# EAGLE design node (EAGLE 8.3.2)
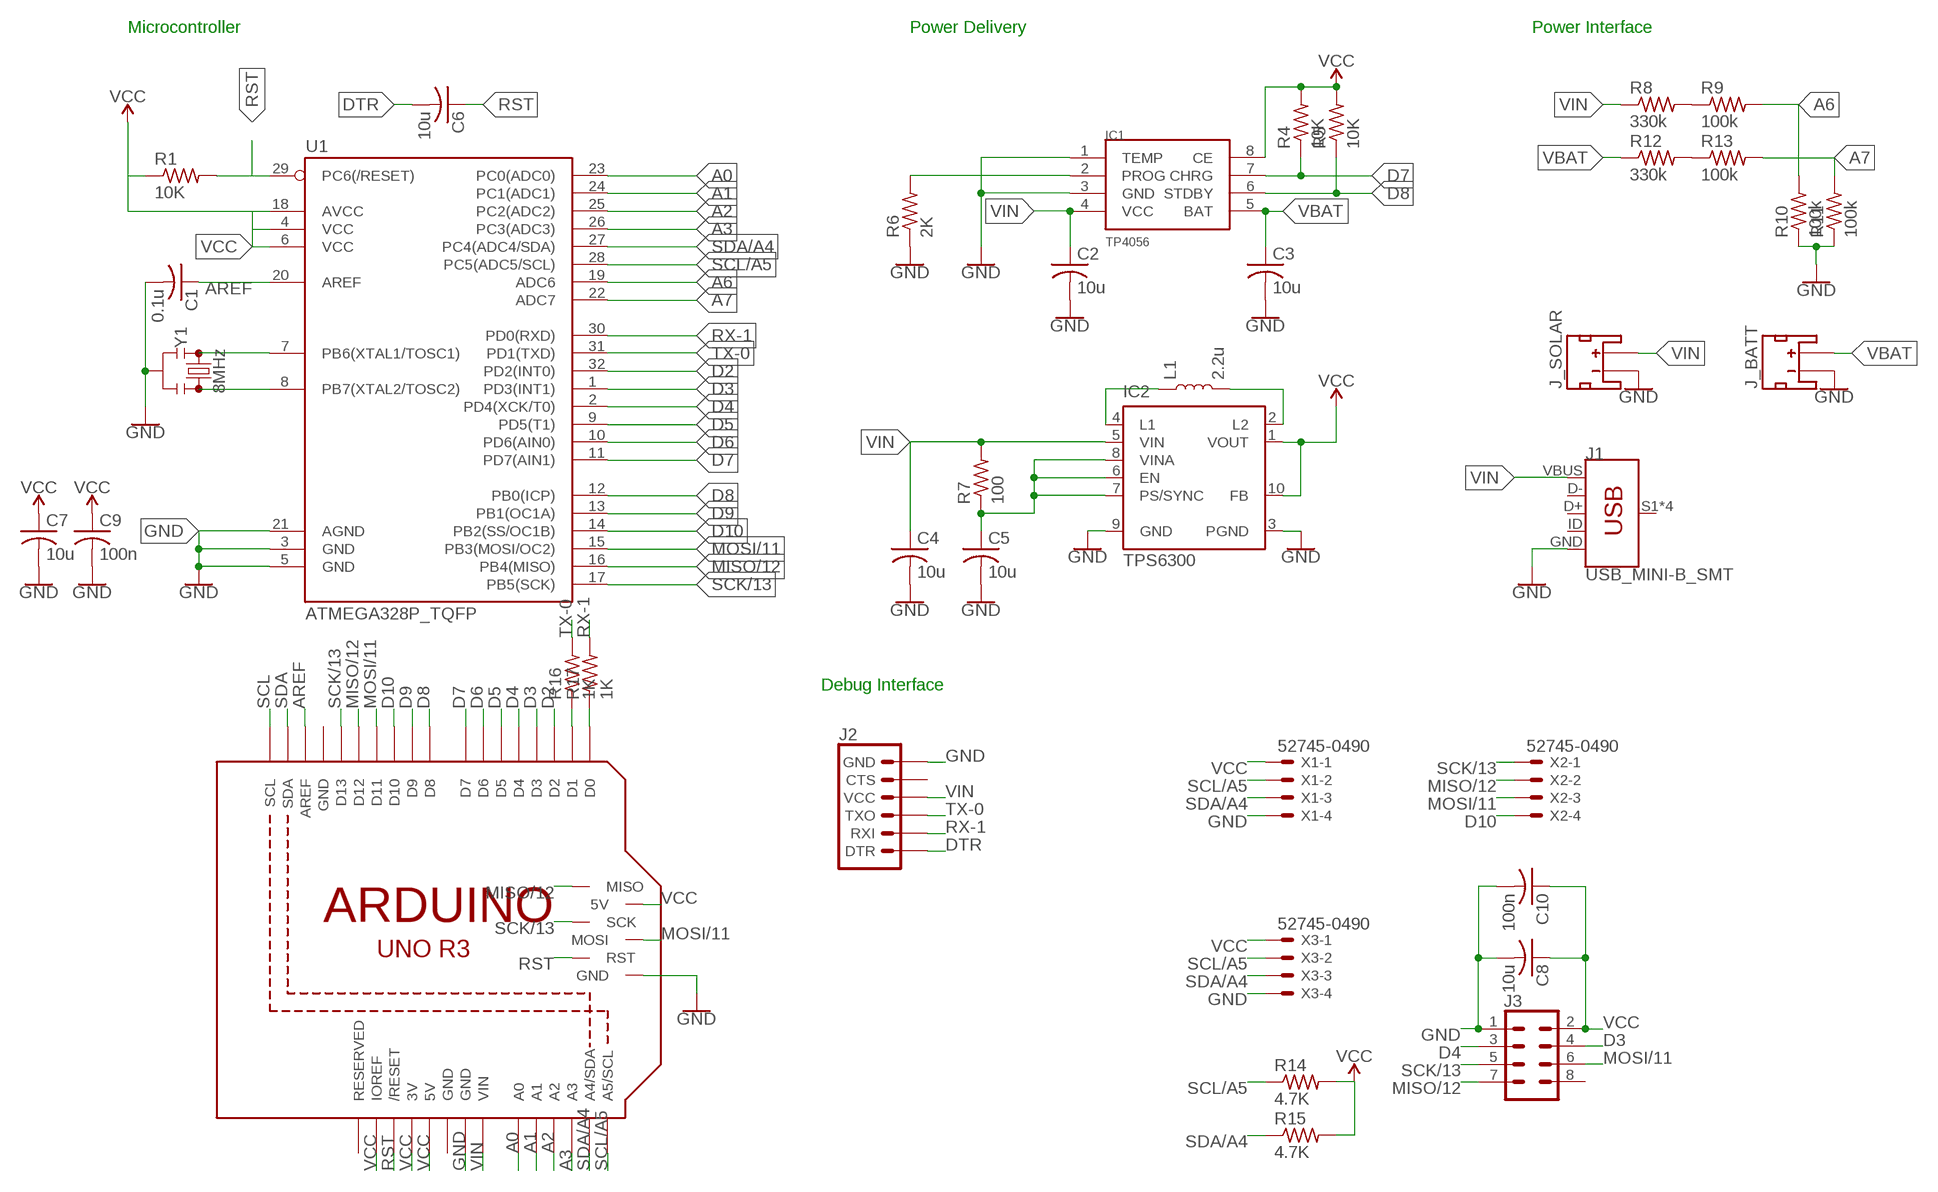
[diagram p0: schematic, sheet 1]

## Parts
C1  0.1u  C-USC0805  [C0805]
C2  10u  C-USC0805  [C0805]
C3  10u  C-USC0805  [C0805]
C4  10u  C-USC0805  [C0805]
C5  10u  C-USC0805  [C0805]
C6  10u  C-USC0805  [C0805]
C7  10u  C-USC0805  [C0805]
C8  10u  C-USC0805  [C0805]
C9  100n  C-USC0805  [C0805]
C10  100n  C-USC0805  [C0805]
IC1  TP4056  [SOP-8]
IC2  TPS6300  [DRC-S-PVSON-N10]
J1  USB_MINI-B_SMT  [USB-MINIB]
J2  6_PIN_SERIAL_TARGETSILK  [6_PIN_SERIAL_TARGET_SIDE_W_SILK]
J3  CONN_04X2  [2X4]
J_BATT  JST_2MM_MALE  [JST-2-SMD]
J_SOLAR  JST_2MM_MALE  [JST-2-SMD]
L1  2.2u  INDUCTOR-0805-3.3UH  [0805]
M1  ARDUINO_R3_ICSP  [ARDUINOR3_ICSP]
R1  10K  R-US_R0805  [R0805]
R4  10K  R-US_R0805  [R0805]
R5  10K  R-US_R0805  [R0805]
R6  2K  R-US_R0805  [R0805]
R7  100  R-US_R0805  [R0805]
R8  330k  R-US_R0805  [R0805]
R9  100k  R-US_R0805  [R0805]
R10  100k  R-US_R0805  [R0805]
R11  100k  R-US_R0805  [R0805]
R12  330k  R-US_R0805  [R0805]
R13  100k  R-US_R0805  [R0805]
R14  4.7K  R-US_R0805  [R0805]
R15  4.7K  R-US_R0805  [R0805]
R16  1K  R-US_R0805  [R0805]
R17  1K  R-US_R0805  [R0805]
U1  ATMEGA328P_TQFP  [TQFP32-08]
X1  52745-0490  [52745-0490]
X2  52745-0490  [52745-0490]
X3  52745-0490  [52745-0490]
Y1  8MHz  RESONATOR-8MHZSMD_3.2X1.3  [RESONATOR-SMD-3.2X1.3]

## Nets
A0: M1.A0 U1.23(PC0(ADC0))
A1: M1.A1 U1.24(PC1(ADC1))
A2: M1.A2 U1.25(PC2(ADC2))
A3: M1.A3 U1.26(PC3(ADC3))
A6: R9.2 R10.2 U1.19(ADC6)
A7: R11.2 R13.2 U1.22(ADC7)
AREF: C1.1 M1.AREF U1.20(AREF)
D2: M1.D2 U1.32(PD2(INT0))
D3: J3.4 M1.D3 U1.1(PD3(INT1))
D4: J3.3 M1.D4 U1.2(PD4(XCK/T0))
D5: M1.D5 U1.9(PD5(T1))
D6: M1.D6 U1.10(PD6(AIN0))
D7: IC1.7(CHRG) M1.D7 R4.1 U1.11(PD7(AIN1))
D8: IC1.6(STDBY) M1.D8 R5.1 U1.12(PB0(ICP))
D9: M1.D9 U1.13(PB1(OC1A))
D10: M1.D10 U1.14(PB2(SS/OC1B)) X2.4
DTR: C6.2 J2.P$1(DTR)
GND: C1.2 C2.2 C3.2 C4.2 C5.2 C7.2 C8.2 C9.2 C10.2 IC1.1(TEMP) IC1.3(GND) IC2.3(PGND) IC2.9(GND) J1.GND J2.P$6(GND) J3.1 J_BATT.1(-) J_SOLAR.1(-) M1.GND@2(GND) M1.GND@3(GND) R6.1 R10.1 R11.1 U1.3(GND) U1.5(GND) U1.21(AGND) X1.4 X3.4 Y1.2
MISO/12: J3.7 M1.D12 M1.MISO U1.16(PB4(MISO)) X2.2
MOSI/11: J3.6 M1.D11 M1.MOSI U1.15(PB3(MOSI/OC2)) X2.3
N$3: U1.8(PB7(XTAL2/TOSC2)) Y1.3
N$4: U1.7(PB6(XTAL1/TOSC1)) Y1.1
N$5: M1.D0 R17.1
N$6: IC2.2(L2) L1.2
N$7: IC2.4(L1) L1.1
N$9: IC1.2(PROG) R6.2
N$10: R8.2 R9.1
N$11: R12.2 R13.1
N$12: M1.D1 R16.1
RST: C6.1 M1.RESET(/RESET) M1.RESET_ICSP(RST) R1.2 U1.29(PC6(/RESET))
RX-1: J2.P$3(RXI) R17.2 U1.30(PD0(RXD))
SCK/13: J3.5 M1.D13 M1.SCK U1.17(PB5(SCK)) X2.1
SCL: M1.SCL
SCL/A5: M1.A5(A5/SCL) R14.1 U1.28(PC5(ADC5/SCL)) X1.2 X3.2
SDA: M1.SDA
SDA/A4: M1.A4(A4/SDA) R15.1 U1.27(PC4(ADC4/SDA)) X1.3 X3.3
TX-0: J2.P$2(TXO) R16.2 U1.31(PD1(TXD))
VBAT: C3.1 IC1.5(BAT) J_BATT.2(+) R12.1
VCC: C7.1 C8.1 C9.1 C10.1 IC1.8(CE) IC2.1(VOUT) IC2.10(FB) J3.2 M1.3V M1.5V M1.5V_ICSP(5V) M1.IOREF R1.1 R4.2 R5.2 R14.2 R15.2 U1.4(VCC) U1.6(VCC) U1.18(AVCC) X1.1 X3.1
VIN: C2.1 C4.1 IC1.4(VCC) IC2.5(VIN) J1.VBUS J2.P$4(VCC) J_SOLAR.2(+) M1.VIN R7.2 R8.1
VINA: C5.1 IC2.6(EN) IC2.7(PS/SYNC) IC2.8(VINA) R7.1
Unconnected: IC2.TH J1.D+ J1.D- J1.ID J1.S1(SHIELD) J1.S2(SHIELD) J1.S3(SHIELD) J1.S4(SHIELD) J2.P$5(CTS) J3.8 J_BATT.NC1(PAD1) J_BATT.NC2(PAD2) J_SOLAR.NC1(PAD1) J_SOLAR.NC2(PAD2) M1.RESERVED

## Notes on the sheet
- Microcontroller | Power Delivery | Power Interface
- Debug Interface

## Power pins joined to a net without a drawn wire
GND: M1.GND M1.GND@1(GND)

## Library data of the parts
C1 = adafruit:C-US: CAPACITOR, American symbol; MF: YAGEO (PHYCOMP); MPN: CC0603KRX7R7BB104; OC_FARNELL: 432210
C2-C10 = adafruit:C-US: CAPACITOR, American symbol; MF: AVX; MPN: 08056D106KAT2A; OC_FARNELL: 1301818
IC1 = TP4056:TP4056; OC_FARNELL: unknown
IC2 = texas:TPS6300*: HIGH EFFICIENT SINGLE INDUCTOR BUCK-BOOST CONVERTER WITH 1.8-A SWITCHES Source: http://focus.ti.com/lit/ds/symlink/tps63001.pdf; MF: TEXAS INSTRUMENTS; MPN: TPS63001DRCT; OC_FARNELL: 1652399; OC_NEWARK: 59M7217
J1 = SparkFun-Connectors:USB_MINI-B: USB type Mini-B Connector Breaks out 5th pin, and includes shield pins if needed. SparkFun Products: SparkFun FTDI Basic Breakout <https://www.sparkfun.com/products/9716> SparkFun XBee Explorer USB <https://www.sparkfun.com/products/11812> SparkFun Redboard <https://www.sparkfun.com/products/12757>; MF: MOLEX; MPN: 67503-1020; OC_FARNELL: 1125348; PROD_ID: CONN-08193; SF_ID: PRT-00587
J2 = SparkFun-Connectors:6_PIN_SERIAL_TARGET: 6-pin header connection for use with the "FTDI BASIC" pinout - TARGET SIDE. Also known as "Arduino Serial Program Header". It is used to mate with our FTDI Basic serial programmers using the Arduino IDE. Note, this device has "TARGET" in the name. It is intended to be used on a design that contains a target micro-controller that you wish to program. The "sister" device, named "CABLE" is inteneded to be used on a design that usually lives on the end of your USB cable and prvides the converter chip (FTDI232 or FTDI231x) to commnicate serial RX/TX. You can populate with some of these: Break Away Headers - Straight <https://www.sparkfun.com/products/116> (PRT-00116) For reference (or to suit your programming needs) check out these designs: SparkFun FTDI Basic Breakout - 5V <https://www.sparkfun.com/products/9716> (DEV-09716) SparkFun FTDI Basic Breakout - 3.3V <https://www.sparkfun.com/products/9873> (DEV-09873) SparkFun FTDI SmartBasic <https://www.sparkfun.com/products/12935> (DEV-12935) SparkFun Beefy 3 - FTDI Basic Breakout <https://www.sparkfun.com/products/13746> (DEV-13746); OC_FARNELL: unknown
J3 = SparkFun-Connectors:CONN_04X2: Multi connection point. Often used as Generic Header-pin footprint for 0.1 inch spaced/style header connections On any of the 0.1 inch spaced packages, you can populate with these: Break Away Headers - Straight <https://www.sparkfun.com/products/116> (PRT-00116) Break Away Male Headers - Right Angle <https://www.sparkfun.com/products/553> (PRT-00553) Female Headers <https://www.sparkfun.com/products/115> (PRT-00115) Break Away Headers - Machine Pin <https://www.sparkfun.com/products/117> (PRT-00117) Break Away Female Headers - Swiss Machine Pin <https://www.sparkfun.com/products/743> (PRT-00743); OC_FARNELL: unknown
J_BATT J_SOLAR = SparkFun-Connectors:JST_2MM_MALE: JST 2MM MALE RA CONNECTOR Two pin, compact surface mount connector. Commonly used as a battery input connection point. We really like the solid locking feeling and high current rating on these small connectors. We use these all the time as battery connectors. Mates to single-cell LiPo batteries. Here is the connector we sell at SparkFun: JST Right Angle Connector - White <https://www.sparkfun.com/products/8612> (PRT-08612) Datasheet <http://www.sparkfun.com/datasheets/Prototyping/Connectors/JST-Horizontal.pdf> It was used on these SparkFun products: SparkFun MOSFET Power Controller <https://www.sparkfun.com/products/11214> (PRT-11214) SparkFun Battery Babysitter - LiPo Battery Manager <https://www.sparkfun.com/products/13777> (PRT-13777) And many, many others that required a lipo battery connection.; MF: JST (JAPAN SOLDERLESS TERMINALS); MPN: S2B-PH-SM4-TB(LF)(SN); OC_FARNELL: 9492615; PROD_ID: CONN-11443; SF_ID: PRT-08612
L1 = SparkFun-Coils:INDUCTOR: Inductors Resist changes in electrical current. Basically a coil of wire. SparkFun Products: SparkFun Load Cell Amplifier - HX711 <https://www.sparkfun.com/products/13879> IOIO-OTG - V2.2 <https://www.sparkfun.com/products/13613>; MF: TDK; MPN: MLF2012A2R2K; OC_FARNELL: 1669547; PROD_ID: NDUC-13076; VALUE: 3.3µH/±20%/450mA
M1 = adafruit:ARDUINO_R3_ICSP; OC_FARNELL: unknown
R1 R4 R5 = adafruit:R-US_: RESISTOR, American symbol; OC_FARNELL: unknown
R6 = adafruit:R-US_: RESISTOR, American symbol; MF: BOURNS; MPN: CR0805-JW-222ELF; OC_FARNELL: 2336287
R7 = adafruit:R-US_: RESISTOR, American symbol; MF: YAGEO (PHYCOMP); MPN: RC0805FR-07100RL; OC_FARNELL: 9237364
R8 R12 = adafruit:R-US_: RESISTOR, American symbol; MF: MULTICOMP; MPN: MC01W08051330K; OC_FARNELL: 2129316
R9-R11 R13 = adafruit:R-US_: RESISTOR, American symbol; MF: VISHAY; MPN: CRCW0805100KFKEA; OC_FARNELL: 1469860
R14 R15 = adafruit:R-US_: RESISTOR, American symbol; MF: YAGEO; MPN: RC0805JR-074K7L; OC_FARNELL: 1799499
R16 R17 = adafruit:R-US_: RESISTOR, American symbol; MF: MULTICOMP; MPN: MC0805S8F1001T5E; OC_FARNELL: 1631371
U1 = SparkFun-IC-Microcontroller:ATMEGA328P_TQFP: Popular 328P in QFP Storefront component: ATmega328 - TQFP <https://www.sparkfun.com/products/13448> (COM-13448) Datasheet <http://www.sparkfun.com/datasheets/Components/SMD/ATMega328.pdf> SparkFun Products SparkFun RedBoard - Programmed with Arduino <https://www.sparkfun.com/products/12757> (DEV-12757) Arduino Pro Mini 328 - 5V/16MHz <https://www.sparkfun.com/products/11113> (DEV-11113) Arduino Pro Mini 328 - 3.3V/8MHz <https://www.sparkfun.com/products/11114> (DEV-11114) SparkFun OpenLog <https://www.sparkfun.com/products/13712> (DEV-13712) SparkFun MicroView - OLED Arduino Module <https://www.sparkfun.com/products/12923> (DEV-12923) SparkFun Digital Sandbox <https://www.sparkfun.com/products/12651> (DEV-12651) SparkFun PicoBoard <https://www.sparkfun.com/products/11888> (WIG-11888) Arduino Fio <https://www.sparkfun.com/products/10116> (DEV-10116) LilyPad Arduino 328 Main Board <https://www.sparkfun.com/products/13342> (DEV-13342) SparkFun RedStick <https://www.sparkfun.com/products/13741> (DEV-13741) LilyPad MP3 <https://www.sparkfun.com/products/11013> (DEV-11013) LilyPad Arduino SimpleSnap <https://www.sparkfun.com/products/10941> (DEV-10941) SparkFun Stepoko <https://www.sparkfun.com/products/13899> (ROB-13899) SparkFun Geiger Counter <https://www.sparkfun.com/products/11345> (SEN-11345) SparkFun EL Sequencer <https://www.sparkfun.com/products/12781> (COM-12781) Arduino Pro 328 - 5V/16MHz <https://www.sparkfun.com/products/10915> (DEV-10915) CryptoCape <https://www.sparkfun.com/products/12773> (DEV-12773) SparkFun IR Thermometer Evaluation Board - MLX90614 <https://www.sparkfun.com/products/10740> (SEN-10740) SparkFun RedBot Mainboard <https://www.sparkfun.com/products/12097> (ROB-12097) Arduino Pro 328 - 3.3V/8MHz <https://www.sparkfun.com/products/10914> (DEV-10914) SparkFun Block for Intel® Edison - Arduino <https://www.sparkfun.com/products/13036> (DEV-13036) SparkFun Simon Says - Surface Mount Soldering Kit <https://www.sparkfun.com/products/10935> (KIT-10935) SparkFun 7-Segment Serial Display - Red <https://www.sparkfun.com/products/11441> (COM-11441) SparkFun 7-Segment Serial Display - White <https://www.sparkfun.com/products/11629> (COM-11629) SparkFun 7-Segment Serial Display - Yellow <https://www.sparkfun.com/products/11443> (COM-11443) SparkFun 7-Segment Serial Display - Kelly Green <https://www.sparkfun.com/products/11440> (COM-11440) SparkFun 7-Segment Serial Display - Blue <https://www.sparkfun.com/products/11442> (COM-11442) SparkFun OpenSegment Serial Display - 20mm (Blue) <https://www.sparkfun.com/products/11647> (COM-11647) SparkFun OpenSegment Serial Display - 20mm (Green) <https://www.sparkfun.com/products/11646> (COM-11646) SparkFun OpenSegment Serial Display - 20mm (White) <https://www.sparkfun.com/products/11648> (COM-11648) SparkFun OpenSegment Serial Display - 20mm (Red) <https://www.sparkfun.com/products/11644> (COM-11644) SparkFun OpenSegment Serial Display - 20mm (Yellow) <https://www.sparkfun.com/products/11645> (COM-11645) SparkFun OpenSegment Shield <https://www.sparkfun.com/products/13190> (DEV-13190); MF: MICROCHIP; MPN: ATMEGA328P-AU; OC_FARNELL: 1715486; PROD_ID: IC-09069
X1-X3 = con-molex:52745-0490: FFC/FPC-to-Board 0.50mm (.020") SMT Top Contact Right Angle, ZIF, Style Receptacle 52745 / 52435 Source: http://www.molex.com/product/ffc/52745.html; MF: MOLEX; MPN: 52745-0497.; OC_FARNELL: 2411449; OC_NEWARK: 61H4699
Y1 = SparkFun-Clocks:RESONATOR-8MHZ: 8MHz Resonator Digikey Example <http://www.digikey.com/product-detail/en/murata-electronics-north-america/CSTCE10M0G55-R0/490-1196-1-ND/584633> Frequency: 8MHz Frequency Stability: ±0.2% Frequency Tolerance: ±0.5% Capacitance: 33pF SparkFun Products Arduino Pro Mini 328- 3.3V/8MHz <https://www.sparkfun.com/products/11114> SparkFun Digital Sandbox <https://www.sparkfun.com/products/12651>; MF: AVX; MPN: PBRC8.00HR50X000; OC_FARNELL: 1209943; PROD_ID: XTAL-08895

## Net classes
1 VCC: width 0.635 mm

## Board
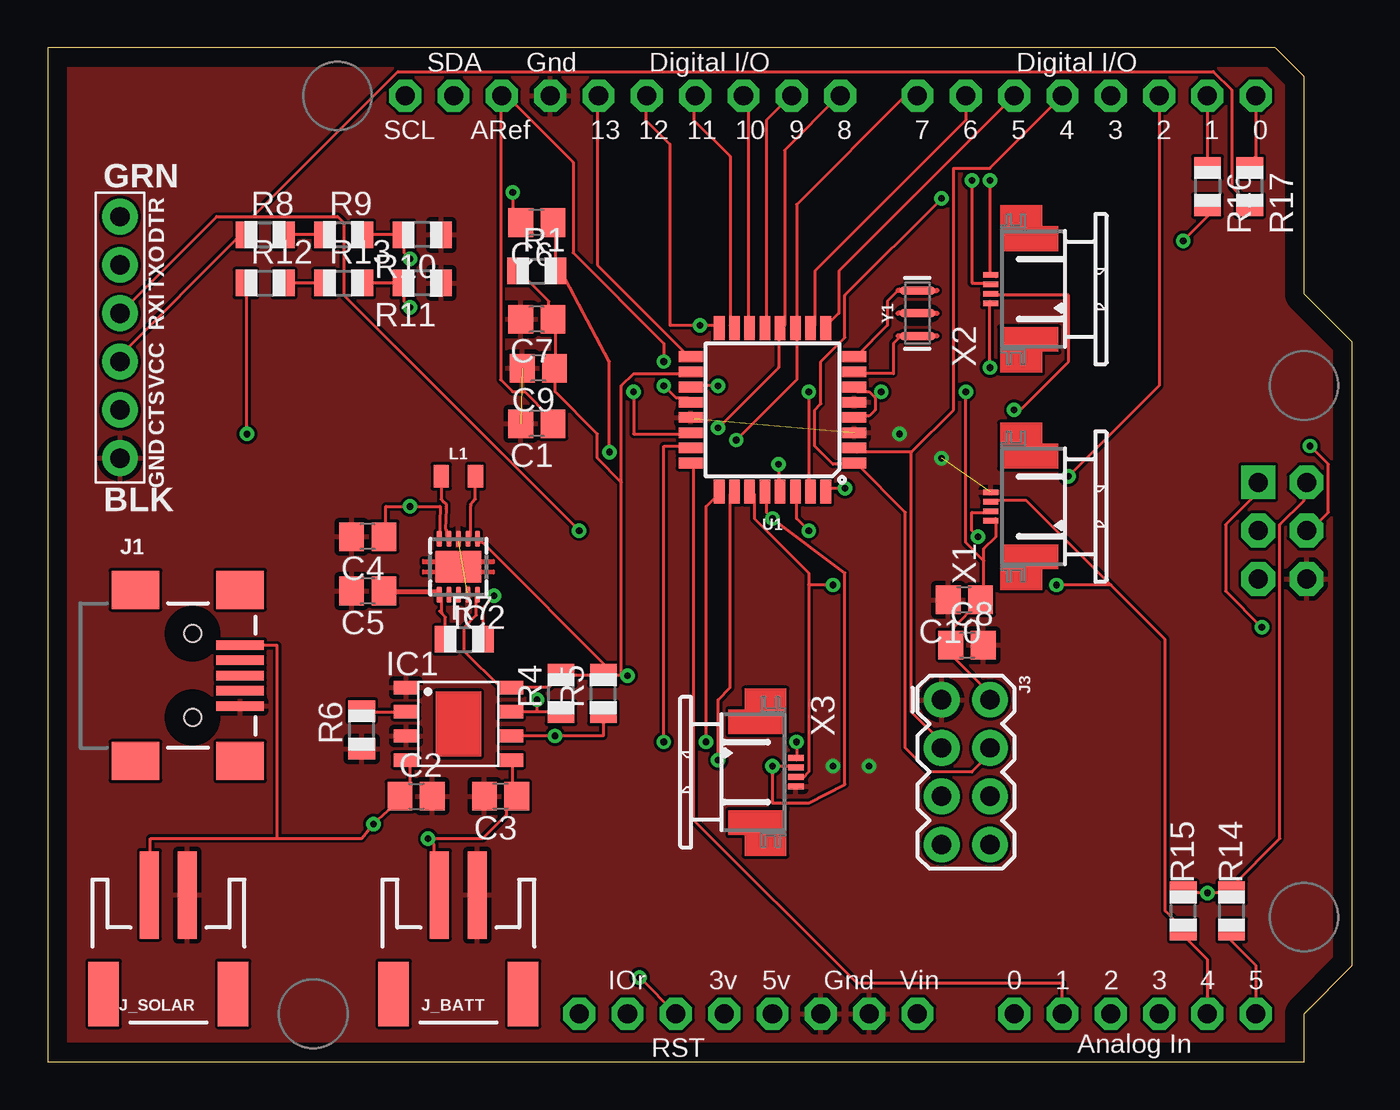
[diagram p1: board, top side]
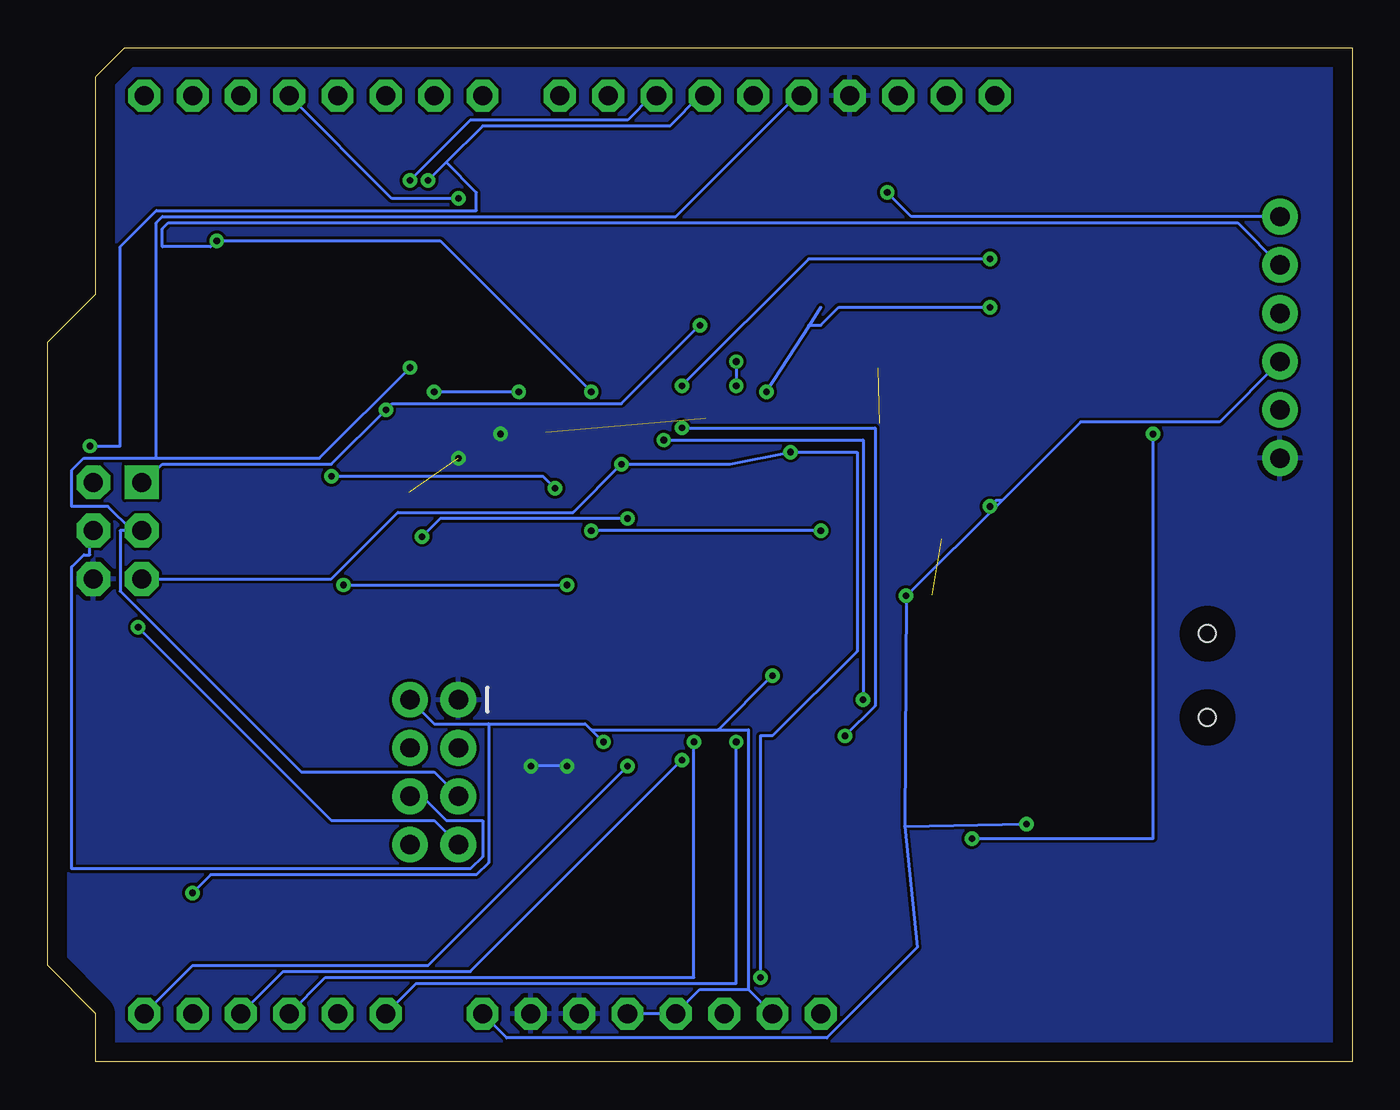
[diagram p2: board, bottom side, seen from below]

Size 68.58 x 53.34 mm. Coordinates in mm from the lower left corner, seen from the top.
Copper layers (1*16): Top 0.035mm / dielectric 1.5mm / Bottom 0.035mm
Design rules "default": minimum track width 6mil, minimum drill 0.35mm, track to track 6mil, track to pad 6mil, pad to pad 6mil, via to via 6mil, smd to smd 6mil, copper to edge 40mil, drill to drill 6mil, minimum pad ring 10mil, minimum via ring 8mil, stop-mask expansion 4mil, vias tented up to drill 0mil, thermal gap 10mil

### Footprints (pad centres in the part's own frame; a part is rotated, then mirrored left to right if it is on the bottom)
C0805 = smd 1.3 x 1.5: 1 -0.85,0; 2 0.85,0
SOP-8 = smd 1.3 x 0.7: 1 -2.75,1.905; 2 -2.75,0.635; 3 -2.75,-0.635; 4 -2.75,-1.905; 5 2.75,-1.905; 6 2.75,-0.635; 7 2.75,0.635; 8 2.75,1.905
DRC-S-PVSON-N10 = smd 0.28 x 0.85: 1 -1,-1.475; 2 -0.5,-1.475; 3 0,-1.475; 4 0.5,-1.475; 5 1,-1.475; 6 1,1.475; 7 0.5,1.475; 8 0,1.475; 9 -0.5,1.475; 10 -1,1.475 | smd 2.4 x 1.65: TH 0,0
USB-MINIB = smd 2.5 x 0.5: D+ 2.5,0; D- 2.5,0.8; GND 2.5,-1.6; ID 2.5,-0.8; VBUS 2.5,1.6 | smd 2.5 x 2: S1 -3,4.5; S2 2.5,4.5; S3 -3,-4.5; S4 2.5,-4.5 | hole 0.9: 0,2.2; 0,-2.2
6_PIN_SERIAL_TARGET_SIDE_W_SILK = drill 1.016 pad 1.88: P$1 -6.35,0; P$2 -3.81,0; P$3 -1.27,0; P$4 1.27,0; P$5 3.81,0; P$6 6.35,0
2X4 = drill 1.016 pad 1.88: 1 -3.81,-1.27; 2 -3.81,1.27; 3 -1.27,-1.27; 4 -1.27,1.27; 5 1.27,-1.27; 6 1.27,1.27; 7 3.81,-1.27; 8 3.81,1.27
JST-2-SMD = smd 1 x 4.6: 1 -1,-3.7; 2 1,-3.7 | smd 1.6 x 3.4: NC1 -3.4,1.5; NC2 3.4,1.5
0805 = smd 0.8 x 1.2: 1 -0.9,0; 2 0.9,0
ARDUINOR3_ICSP = drill 1 pad 1.676 octagon: 3V 35.56,2.54; 5V 38.1,2.54; A0 50.8,2.54; A1 53.34,2.54; A2 55.88,2.54; A3 58.42,2.54; A4 60.96,2.54; A5 63.5,2.54; AREF 23.876,50.8; D0 63.5,50.8; D1 60.96,50.8; D2 58.42,50.8; D3 55.88,50.8; D4 53.34,50.8; D5 50.8,50.8; D6 48.26,50.8; D7 45.72,50.8; D8 41.656,50.8; D9 39.116,50.8; D10 36.576,50.8; D11 34.036,50.8; D12 31.496,50.8; D13 28.956,50.8; GND 26.416,50.8; GND@1 43.18,2.54; GND@2 40.64,2.54; IOREF 30.48,2.54; RESERVED 27.94,2.54; RESET 33.02,2.54; SCL 18.796,50.8; SDA 21.336,50.8; VIN 45.72,2.54 | drill 1 pad 1.778 octagon: 5V_ICSP 66.167,30.48; GND@3 66.167,25.4; MOSI 66.167,27.94; RESET_ICSP 63.627,25.4; SCK 63.627,27.94 | drill 1 pad 1.778 square: MISO 63.627,30.48
R0805 = smd 1.1 x 1.4: 1 -1,0; 2 1,0
TQFP32-08 = smd 1.27 x 0.559: 1 -4.293,2.8; 2 -4.293,2; 3 -4.293,1.2; 4 -4.293,0.4; 5 -4.293,-0.4; 6 -4.293,-1.2; 7 -4.293,-2; 8 -4.293,-2.8; 17 4.293,-2.8; 18 4.293,-2; 19 4.293,-1.2; 20 4.293,-0.4; 21 4.293,0.4; 22 4.293,1.2; 23 4.293,2; 24 4.293,2.8 | smd 0.559 x 1.27: 9 -2.8,-4.293; 10 -2,-4.293; 11 -1.2,-4.293; 12 -0.4,-4.293; 13 0.4,-4.293; 14 1.2,-4.293; 15 2,-4.293; 16 2.8,-4.293; 25 2.8,4.293; 26 2,4.293; 27 1.2,4.293; 28 0.4,4.293; 29 -0.4,4.293; 30 -1.2,4.293; 31 -2,4.293; 32 -2.8,4.293
52745-0490 = smd 0.3 x 0.8: 1 -0.75,2.5; 2 -0.25,2.5; 3 0.25,2.5; 4 0.75,2.5
RESONATOR-SMD-3.2X1.3 = smd 0.45 x 1.905: 1 -1.2,0; 2 0,0; 3 1.2,0

### Placement (x,y rotation side)
C1  25.72,33.56 180 top
C2  19.37,13.97 0 top
C3  23.81,13.97 180 top
C4  16.83,27.62 180 top
C5  16.83,24.77 180 top
C6  25.72,44.13 180 top
C7  25.72,39.05 180 top
C8  48.32,21.92 0 top
C9  25.8,36.48 180 top
C10  48.19,24.3 180 top
IC1  21.59,17.78 0 top
IC2  21.59,26.04 180 top
J1  7.62,20.32 0 top
J2  3.81,38.1 270 top
J3  48.26,15.24 270 top
J_BATT  21.59,5.08 180 top
J_SOLAR  6.35,5.08 180 top
L1  21.59,30.8 0 top
M1  0,0 0 top
R1  25.72,41.59 0 top
R4  26.99,19.37 90 top
R5  29.21,19.37 90 top
R6  16.51,17.46 90 top
R7  21.91,22.23 0 top
R8  11.43,43.5 0 top
R9  15.56,43.5 0 top
R10  19.68,43.5 180 top
R11  19.68,40.96 180 top
R12  11.43,40.96 0 top
R13  15.56,40.96 0 top
R14  62.23,7.94 90 top
R15  59.69,7.94 90 top
R16  60.96,46.04 270 top
R17  63.18,46.04 270 top
U1  38.1,34.29 180 top
X1  52.07,29.21 90 top
X2  52.07,40.64 90 top
X3  36.83,15.24 270 top
Y1  45.72,39.37 90 top

### Tracks (layer width: path | path; a pad name or v marks a point on that pad's centre or on a via)
A0  (via drill 0.35)
  Top 0.152: v32.38,16.83 32.38,32.38 33.66,32.38 U1.23
  Bottom 0.152: v32.38,16.83 32.38,4.13 49.21,4.13 M1.A0
A1
  Top 0.152: M1.A1 53.34,4.13 42.55,4.13 33.97,12.7 33.97,31.43 U1.24
A2  (via drill 0.35)
  Top 0.152: v34.61,16.83 34.61,29.21 35.24,29.84 U1.25
  Bottom 0.152: v34.61,16.83 34.61,4.45 53.98,4.45 M1.A2
A3  (via drill 0.35)
  Top 0.152: v35.24,15.88 35.24,19.05 35.88,19.68 35.88,29.84 U1.26
  Bottom 0.152: v35.24,15.88 46.35,4.76 56.2,4.76 M1.A3
A6  (via drill 0.35)
  Top 0.152: v35.24,35.56 33.97,35.56 U1.19 | v19.05,42.23 18.73,42.55 18.73,43.5 R10.2 R9.2
  Bottom 0.152: v35.24,35.56 28.57,42.23 v19.05,42.23
A7  (via drill 0.35)
  Top 0.152: v30.8,35.24 30.8,33.02 33.66,33.02 U1.22 | v19.05,39.69 18.73,40.01 18.73,40.96 R11.2 R13.2
  Bottom 0.152: 27.94,39.69 28.56,38.73 | 28.56,38.73 v30.8,35.24 | v19.05,39.69 26.99,39.69 27.94,38.73 28.57,38.73 28.56,38.73
AREF  (via drill 0.35)
  Top 0.152: v32.38,35.56 33.02,34.92 33.66,34.92 U1.20 | v32.38,36.83 32.38,37.78 27.62,42.55 27.62,47.31 24.13,50.8 M1.AREF 23.81,50.8 23.81,35.88 24.45,35.24 25.08,35.24 26.35,33.97 26.35,33.66 C1.1
  Bottom 0.152: v32.38,36.83 v32.38,35.56
D2  (via drill 0.35)
  Top 0.152: v41.91,30.16 40.96,30.16 U1.32 | v53.66,30.8 58.42,35.56 M1.D2
  Bottom 0.152: v41.91,30.16 42.55,30.8 v53.66,30.8
D3  (via drill 0.35)
  Top 0.152: J3.4 49.53,16.19 48.58,15.24 46.35,15.24 45.09,16.51 45.09,28.89 42.55,31.43 U1.1 42.23,31.43 41.27,31.43 40.32,32.38 40.32,34.29 40.64,34.61 40.64,36.83 41.91,38.1 41.91,40.32 v46.99,45.4
  Bottom 0.152: M1.D3 50.48,45.4 v46.99,45.4
D4
  Top 0.152: 45.4,32.07 42.55,32.07 U1.2 | 45.4,32.07 45.4,18.41 46.99,16.83 J3.3 | M1.D4 49.53,46.99 47.62,46.99 47.62,34.29 45.4,32.07
D5
  Top 0.152: M1.D5 41.59,41.59 41.59,39.37 40.96,38.73 U1.9
D6
  Top 0.152: M1.D6 48.26,49.53 40.32,41.59 40.32,38.73 U1.10
D7  (via drill 0.35)
  Top 0.152: 25.72,18.41 26.99,18.41 R4.1 | 25.72,18.41 IC1.7 | M1.D7 45.09,50.8 39.37,45.09 39.37,38.73 U1.11 39.37,38.42 39.37,35.88 v36.2,32.7 | v25.72,19.05 25.72,18.41
  Bottom 0.152: v25.72,19.05 25.72,32.7 v36.2,32.7
D8  (via drill 0.35)
  Top 0.152: IC1.6 v26.67,17.14 29.21,17.14 R5.1 | M1.D8 41.59,50.8 38.73,47.94 38.73,38.73 U1.12 38.42,38.42 38.42,36.51 v35.24,33.34
  Bottom 0.152: v26.67,17.14 25.08,18.73 25.08,33.34 v35.24,33.34
D9
  Top 0.152: U1.13 37.78,38.73 37.78,49.53 39.05,50.8 M1.D9
D10  (via drill 0.35)
  Top 0.152: v49.53,46.35 49.53,41.59 49.85,41.27 X2.4 | U1.14 36.83,38.73 36.83,50.8 M1.D10
  Bottom 0.152: v49.53,46.35 46.35,49.53 38.1,49.53 36.83,50.8 M1.D10
DTR  (via drill 0.35)
  Top 0.152: v24.45,45.72 24.45,44.45 24.77,44.13 C6.2
  Bottom 0.152: v24.45,45.72 23.18,44.45 J2.P$1
GND  (via drill 0.35)  (4 unrouted)
  Top 0.152: U1.21 33.97,33.97 33.97,33.83 | U1.21 33.83,33.98 33.87,33.95 33.81,33.97 U1.21 | 33.98,33.83 U1.21
  Bottom 0.152: v41.27,15.56 v43.18,15.56
  other vias: 44.77,33.02 46.99,31.75
  pour Top: -2.54,55.88 -2.54,-2.54 69.85,-2.54 69.85,57.15 -2.54,57.15
  pour Bottom: -4.76,59.69 -4.76,-5.08 77.15,-5.08 77.47,-4.76 77.47,58.74 76.83,59.37 -4.13,59.37 -4.45,59.69 -3.81,59.69 -3.17,60.33
MISO/12  (via drill 0.35)
  Top 0.152: U1.16 35.24,38.73 v34.29,38.73 32.7,38.73 32.7,48.26 31.43,49.53 31.43,50.8 M1.D12 | v50.8,34.29 51.12,34.29 53.66,36.83 53.66,40.32 49.85,40.32 X2.2 | v63.82,22.86 61.91,24.77 61.91,28.26 63.5,29.84 63.5,30.48 M1.MISO
  Bottom 0.152: M1.MISO 63.5,30.48 62.55,31.43 53.66,31.43 v50.8,34.29 50.48,34.61 38.42,34.61 v34.29,38.73 | J3.7 48.26,12.7 53.66,12.7 v63.82,22.86
MOSI/11  (via drill 0.35)
  Top 0.152: v48.58,46.35 48.58,40.96 49.53,40.96 X2.3 | U1.15 35.88,38.73 35.88,47.62 33.97,49.53 33.97,50.8 M1.D11 | v66.36,32.38 67.31,31.43 67.31,28.89 66.36,27.94 M1.MOSI
  Bottom 0.152: 47.62,47.31 45.72,49.21 35.88,49.21 34.29,50.8 M1.D11 | 47.62,47.31 v48.58,46.35 | J3.6 48.9,13.97 47.62,12.7 45.72,12.7 45.72,10.79 46.35,10.16 67.31,10.16 67.31,26.04 66.67,26.67 66.36,26.67 66.36,27.94 M1.MOSI | 47.62,47.31 46.04,45.72 46.04,44.77 62.87,44.77 64.77,42.86 64.77,32.38 v66.36,32.38
N$3
  Top 0.152: U1.8 42.55,37.15 44.13,38.73 44.13,40.01 44.77,40.64 44.7,40.57
N$4
  Top 0.152: U1.7 42.55,36.2 44.45,36.2 44.45,37.78 44.77,38.1 44.7,38.17
N$5
  Top 0.152: M1.D0 63.5,47.62 63.18,47.31 R17.1
N$6
  Top 0.152: L1.2 22.49,29.59 22.32,29.43 22.24,29.34 22.24,29.33 22.23,29.33 22.24,29.22 22.23,29.21 22.23,27.99 22.22,27.99 22.22,27.64 IC2.2
N$7
  Top 0.152: IC2.4 20.96,27.64 20.96,27.99 20.91,28.03 20.94,29.08 20.94,29.21 20.95,29.33 20.94,29.33 20.94,29.34 20.86,29.43 20.69,29.59 L1.1
N$9
  Top 0.152: IC1.2 16.51,18.41 R6.2
N$10
  Top 0.152: R9.1 R8.2
N$11
  Top 0.152: R13.1 R12.2
N$12
  Top 0.152: M1.D1 R16.1
RST  (via drill 0.35)
  Top 0.152: C6.1 26.67,44.13 26.67,41.59 R1.2 26.99,41.59 29.53,36.83 v29.53,32.07 | v38.42,31.43 38.42,30.16 U1.29 | v31.11,4.45 M1.RESET
  Bottom 0.152: M1.RESET_ICSP 53.66,25.4 50.16,28.89 40.96,28.89 v38.42,31.43 32.7,31.43 v29.53,32.07 26.04,32.07 26.04,21.59 30.48,17.14 31.11,17.14 v31.11,4.45
RX-1  (via drill 0.35)
  Top 0.152: v40.01,27.94 39.37,28.57 39.37,29.84 U1.30 | v27.94,27.94 15.56,40.32 15.56,44.13 15.24,44.45 10.79,44.45 | 10.79,44.45 8.89,44.45 J2.P$3 | 10.79,44.45 18.41,52.07 61.28,52.07 62.23,51.12 62.23,46.04 63.18,45.09 R17.2
  Bottom 0.152: v27.94,27.94 v40.01,27.94
SCK/13  (via drill 0.35)
  Top 0.152: U1.17 33.66,37.15 28.89,41.91 28.89,50.8 M1.D13 | v49.53,36.51 49.53,40.01 X2.1
  Bottom 0.152: v49.53,36.51 54.29,31.75 62.87,31.75 | 62.87,31.75 66.67,31.75 67.31,31.11 67.31,29.21 65.41,29.21 64.14,27.94 | 64.14,27.94 M1.SCK 63.82,27.94 | J3.5 48.26,15.24 55.24,15.24 64.77,24.77 64.77,27.94 64.14,27.94 | 62.87,31.75 62.87,44.13 62.55,44.45 35.56,44.45 29.21,50.8 M1.D13
SCL/A5  (via drill 0.35)
  Top 0.152: R14.1 62.23,6.35 63.5,5.08 M1.A5 | v48.9,27.62 48.58,27.94 48.58,28.89 49.53,28.89 X1.2 | U1.28 37.78,29.84 37.78,28.89 v38.1,28.57 41.91,25.72 41.91,14.61 40,13.61 38.09,13.61 v38.1,15.56 39.05,15.56 X3.2
  Bottom 0.152: v48.9,27.62 47.94,28.57 v38.1,28.57 | v38.1,15.56 48.58,5.08 60.96,5.08 M1.A5
SDA/A4  (via drill 0.35)
  Top 0.152: 40.01,25.08 40.01,25.72 37.15,28.57 37.15,29.84 U1.27 | 40.01,25.08 40.01,15.24 39.69,14.92 39.37,14.92 X3.3 | 55.88,25.08 58.74,22.23 58.74,7.94 59.69,6.99 R15.1 59.69,6.67 60.96,5.4 M1.A4 | 55.88,25.08 51.44,29.53 49.85,29.53 X1.3 | v41.27,25.08 40.01,25.08 | 55.88,25.08 v53.02,25.08
  Bottom 0.152: v53.02,25.08 v41.27,25.08
TX-0  (via drill 0.35)
  Top 0.152: v40.01,35.24 40.01,30.16 U1.31 | v59.69,43.18 60.96,44.45 R16.2
  Bottom 0.152: v40.01,35.24 47.94,43.18 v59.69,43.18 60.01,42.86 62.55,42.86 62.55,43.81 62.23,44.13 6.03,44.13 J2.P$2
VBAT  (via drill 0.35)
  Top 0.152: IC1.5 24.45,15.88 24.45,13.97 C3.1 24.13,13.97 24.13,13.02 22.86,11.75 v20,11.75 20.32,11.43 20.32,8.89 J_BATT.2 | v10.48,33.02 10.48,40.96 R12.1
  Bottom 0.152: v10.48,33.02 10.48,11.75 v20,11.75
VCC  (via drill 0.35)
  Top 0.152: R1.1 24.77,41.59 26.35,40.01 26.35,39.05 C7.1 26.67,39.05 26.67,36.51 C9.1 26.67,36.2 26.67,35.24 28.89,33.02 28.89,31.75 30.16,30.48 | 29.21,20.32 26.99,20.32 | R15.2 59.69,8.89 v60.96,8.89 62.23,8.89 R14.2 62.23,9.21 64.77,11.75 64.77,28.26 66.04,29.53 66.04,30.48 M1.5V_ICSP | v39.37,16.83 39.37,15.88 X3.1 | 47.62,22.86 47.62,21.27 49.53,19.37 J3.2 | 47.62,22.86 C8.1 | 30.16,20.32 29.84,20.32 | 29.84,20.32 29.21,20.32 | 29.21,20.32 R5.2 29.84,20.32 | 43.5,34.92 43.5,34.29 43.18,33.97 42.55,33.97 U1.4 | 43.5,34.92 43.18,35.24 42.55,35.24 U1.6 | 49.21,26.35 49.21,24.45 C10.1 48.9,24.13 47.62,22.86 | 49.21,26.35 49.21,26.99 49.85,27.62 49.85,28.57 X1.1 | v43.81,35.24 43.5,34.92 | v48.26,35.24 48.26,27.3 49.21,26.35 | IC2.10 22.54,24.45 22.54,23.5 21.91,22.86 21.91,21.59 23.81,19.68 IC1.8 26.35,19.68 26.99,20.32 | 29.84,20.32 22.86,27.3 22.54,27.3 IC2.1 | 30.16,20.32 30.16,30.48 | 30.16,30.48 30.16,35.56 30.8,36.2 33.66,36.2 U1.18 | 30.16,20.32 v30.48,20.32 | 26.99,20.32 R4.2
  Bottom 0.152: 31.75,3.81 M1.IOREF | 31.75,3.81 34.29,3.81 M1.3V M1.5V | 40.01,17.46 40.32,17.78 45.4,17.78 | 40.01,17.46 v39.37,16.83 | 45.4,17.78 48.26,17.78 J3.2 | v60.96,8.89 60.01,9.84 46.04,9.84 45.4,10.48 45.4,17.78 | 31.75,3.81 31.75,17.46 33.34,17.46 | 40.01,17.46 33.34,17.46 | 33.34,17.46 v30.48,20.32 | v48.26,35.24 v43.81,35.24
VIN  (via drill 0.35)
  Top 0.152: IC1.4 19.05,15.88 19.05,13.97 C2.1 18.73,13.97 v17.12,12.51 16.51,11.75 12.06,11.75 | 12.06,11.75 5.4,11.75 5.4,8.89 J_SOLAR.2 | 12.06,11.75 12.06,21.91 10.16,21.91 J1.VBUS | IC2.5 20.64,29.21 v19.05,29.21 17.78,29.21 17.78,27.62 C4.1 | v23.46,24.51 22.86,23.81 R7.2 | J2.P$4 3.81,37.15 10.16,43.5 R8.1
  Bottom 0.152: 18.41,29.53 14.29,33.66 6.99,33.66 J2.P$4 | 18.41,29.53 v23.46,24.51 23.53,12.39 | v19.05,29.21 18.73,29.53 18.41,29.53 | M1.VIN 44.45,1.27 27.62,1.27 22.86,6.03 23.53,12.39 | 23.53,12.39 v17.12,12.51
VINA
  Top 0.152: 20.64,24.77 C5.1 17.68,24.69 20.57,24.69 IC2.6 20.73,24.54 | R7.1 20.91,23.39 20.7,23.6 | 20.7,23.6 20.6,23.7 | 20.73,24.54 21.03,24.54 IC2.7 21.18,24.54 21.49,24.54 IC2.8 | 20.73,24.54 20.73,23.62 20.7,23.6